# EAGLE design REL1 (EAGLE 5.10)
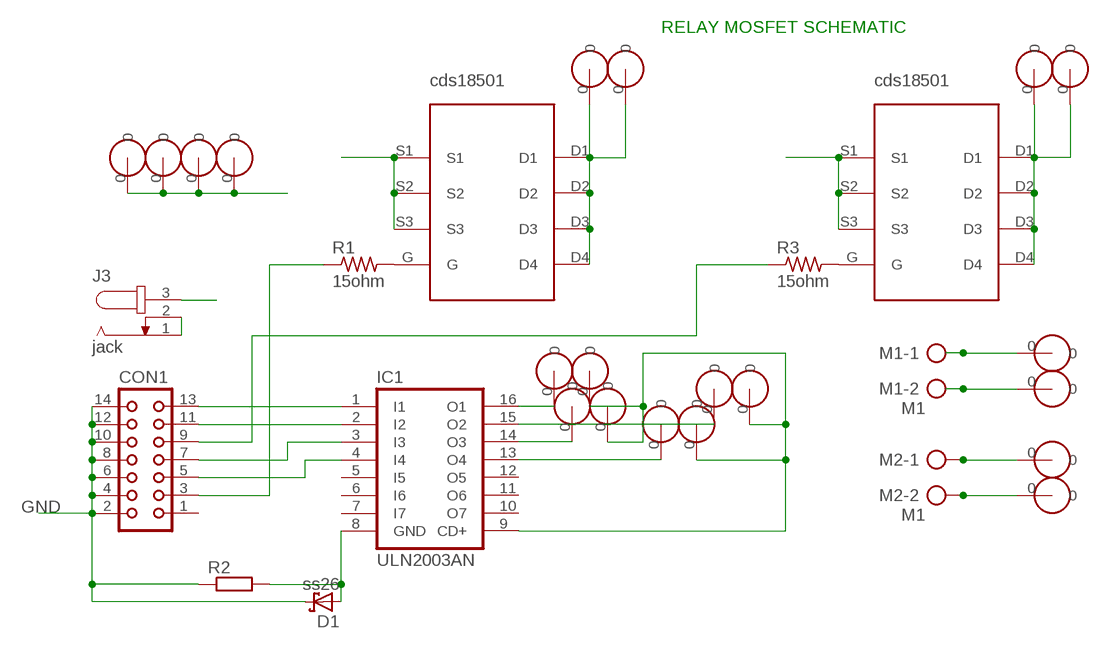
[diagram p0: schematic, sheet 1]

## Parts
24V  PAD0  [SWITCHPAD]
CON1  CON14  [CON14]
D1  ss26  SCHOTTKY-DIODESMD  [SMB]
IC1  ULN2003AN  [DIL16]
J3  jack  JACK-PLUG0  [SPC4077]
M1  M1  AK300/2  [AK300/2]
M2  M1  AK300/2  [AK300/2]
R1  15ohm  R-US_M1206  [M1206]
R2  R-EU_0414/15  [0414/15]
R3  15ohm  R-US_M1206  [M1206]
U$1  PAD0  [SWITCHPAD]
U$2  PAD0  [SWITCHPAD]
U$3  PAD0  [SWITCHPAD]
U$4  PAD0  [SWITCHPAD]
U$5  PAD0  [SWITCHPAD]
U$6  PAD0  [SWITCHPAD]
U$7  PAD0  [SWITCHPAD]
U$8  PAD0  [SWITCHPAD]
U$9  PAD0  [SWITCHPAD]
U$10  PAD0  [SWITCHPAD]
U$11  CSD18503GDS-NEW  [CDS]
U$12  CSD18503GDS-NEW  [CDS]
U$13  PAD0  [SWITCHPAD]
U$14  PAD0  [SWITCHPAD]
U$15  PAD0  [SWITCHPAD]
U$16  PAD0  [SWITCHPAD]
U$17  PAD0  [SWITCHPAD]
U$18  PAD0  [SWITCHPAD]
U$19  PAD0  [SWITCHPAD]
U$20  PAD0  [SWITCHPAD]
U$21  PAD0  [SWITCHPAD]

## Nets
24V: 24V.0 IC1.9(CD+) J3.3 U$3.0 U$4.0 U$6.0 U$8.0 U$9.0 U$10.0 U$21.0
GND: CON1.2 CON1.4 CON1.6 CON1.8 CON1.10 CON1.12 CON1.14 D1.C J3.1 J3.2 R2.1 U$11.S1 U$11.S2 U$11.S3 U$12.S1 U$12.S2 U$12.S3
N$2: IC1.16(O1) U$1.0
N$3: CON1.5 IC1.4(I4)
N$4: IC1.14(O3) U$5.0
N$5: CON1.7 IC1.3(I3)
N$6: IC1.13(O4) U$7.0
N$7: CON1.11 IC1.2(I2)
N$8: CON1.13 IC1.1(I1)
N$9: IC1.15(O2) U$2.0
N$10: R1.2 U$11.G
N$11: R3.2 U$12.G
N$12: CON1.3 R1.1
N$13: CON1.9 R3.1
N$14: U$11.D1 U$11.D2 U$11.D3 U$11.D4 U$13.0 U$15.0
N$15: D1.A IC1.8(GND) R2.2
N$16: U$12.D1 U$12.D2 U$12.D3 U$12.D4 U$14.0 U$16.0
N$17: M1.2 U$18.0
N$18: M1.1 U$17.0
N$19: M2.1 U$19.0
N$20: M2.2 U$20.0
Unconnected: CON1.1 IC1.5(I5) IC1.6(I6) IC1.7(I7) IC1.10(O7) IC1.11(O6) IC1.12(O5)

## Notes on the sheet
- RELAY MOSFET SCHEMATIC

## Library data of the parts
24V U$1-U$10 U$13-U$21 = switchpad:PAD
CON1 = con-harting:CON14: CONNECTOR
D1 = diode:SCHOTTKY-DIODE: Schottky Diode
IC1 = uln-udn:ULN2003A: DRIVER ARRAY
J3 = con-jack:JACK-PLUG: DC POWER JACK Power Jack, DC, Right Angle, Through Hole, Rated 5A at 16VDC, PC Terminals Distributor: Farnell (www.Farnell.de) Drawing: 84N1161.pdf / 84N1162.pdf Manufacturer: SPC Technology (www.spctechnology.com) Type: SPC4077 / SPC 4078
M1 M2 = con-ptr500:AK300/2: CONNECTOR
R1 R3 = rcl:R-US_: RESISTOR, American symbol
R2 = rcl:R-EU_: RESISTOR, European symbol
U$11 U$12 = cds_new:CSD18503GDS-NEW

## Board
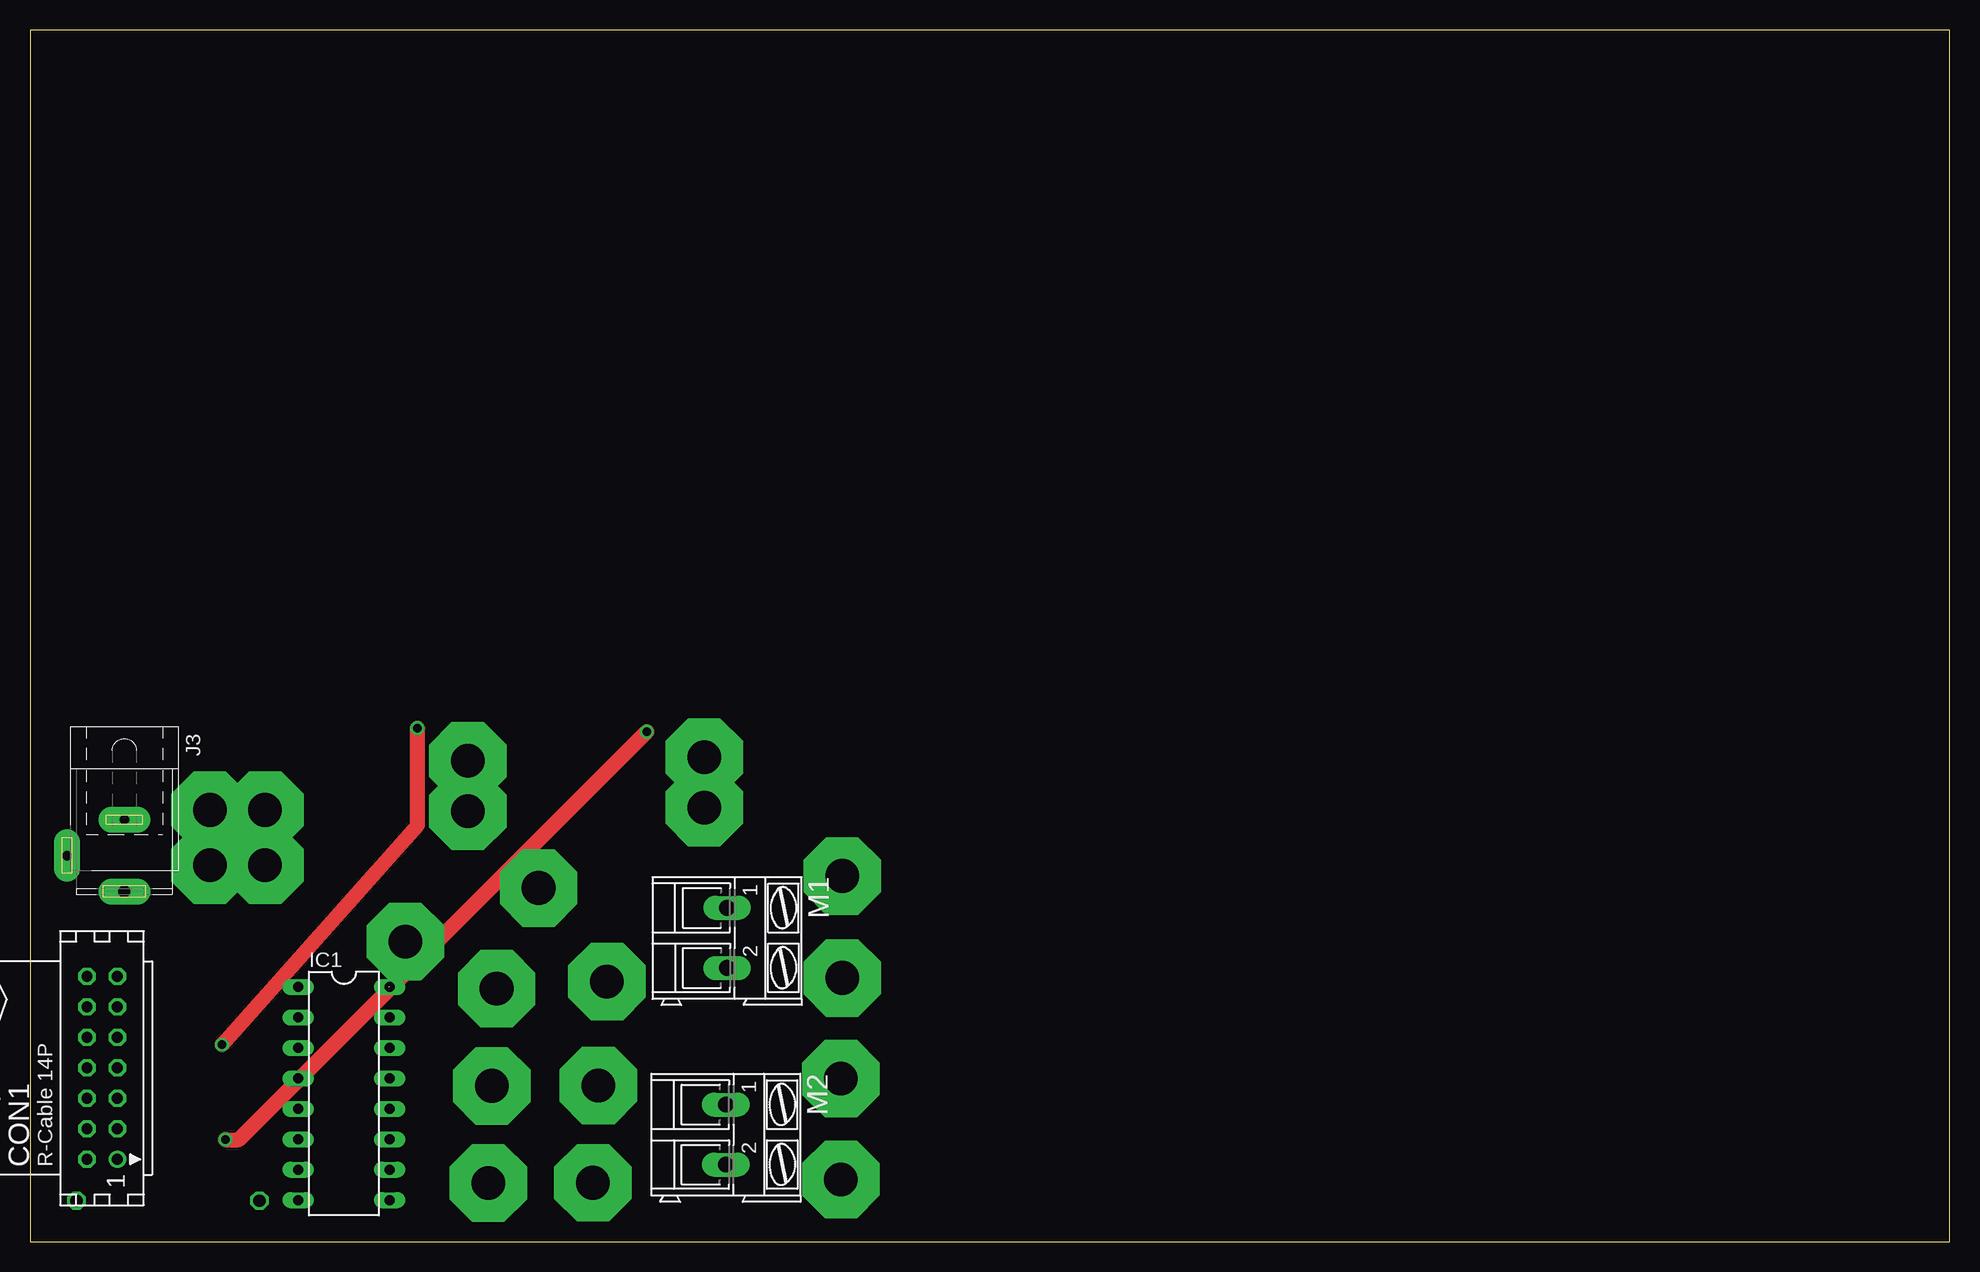
[diagram p1: board, top side]
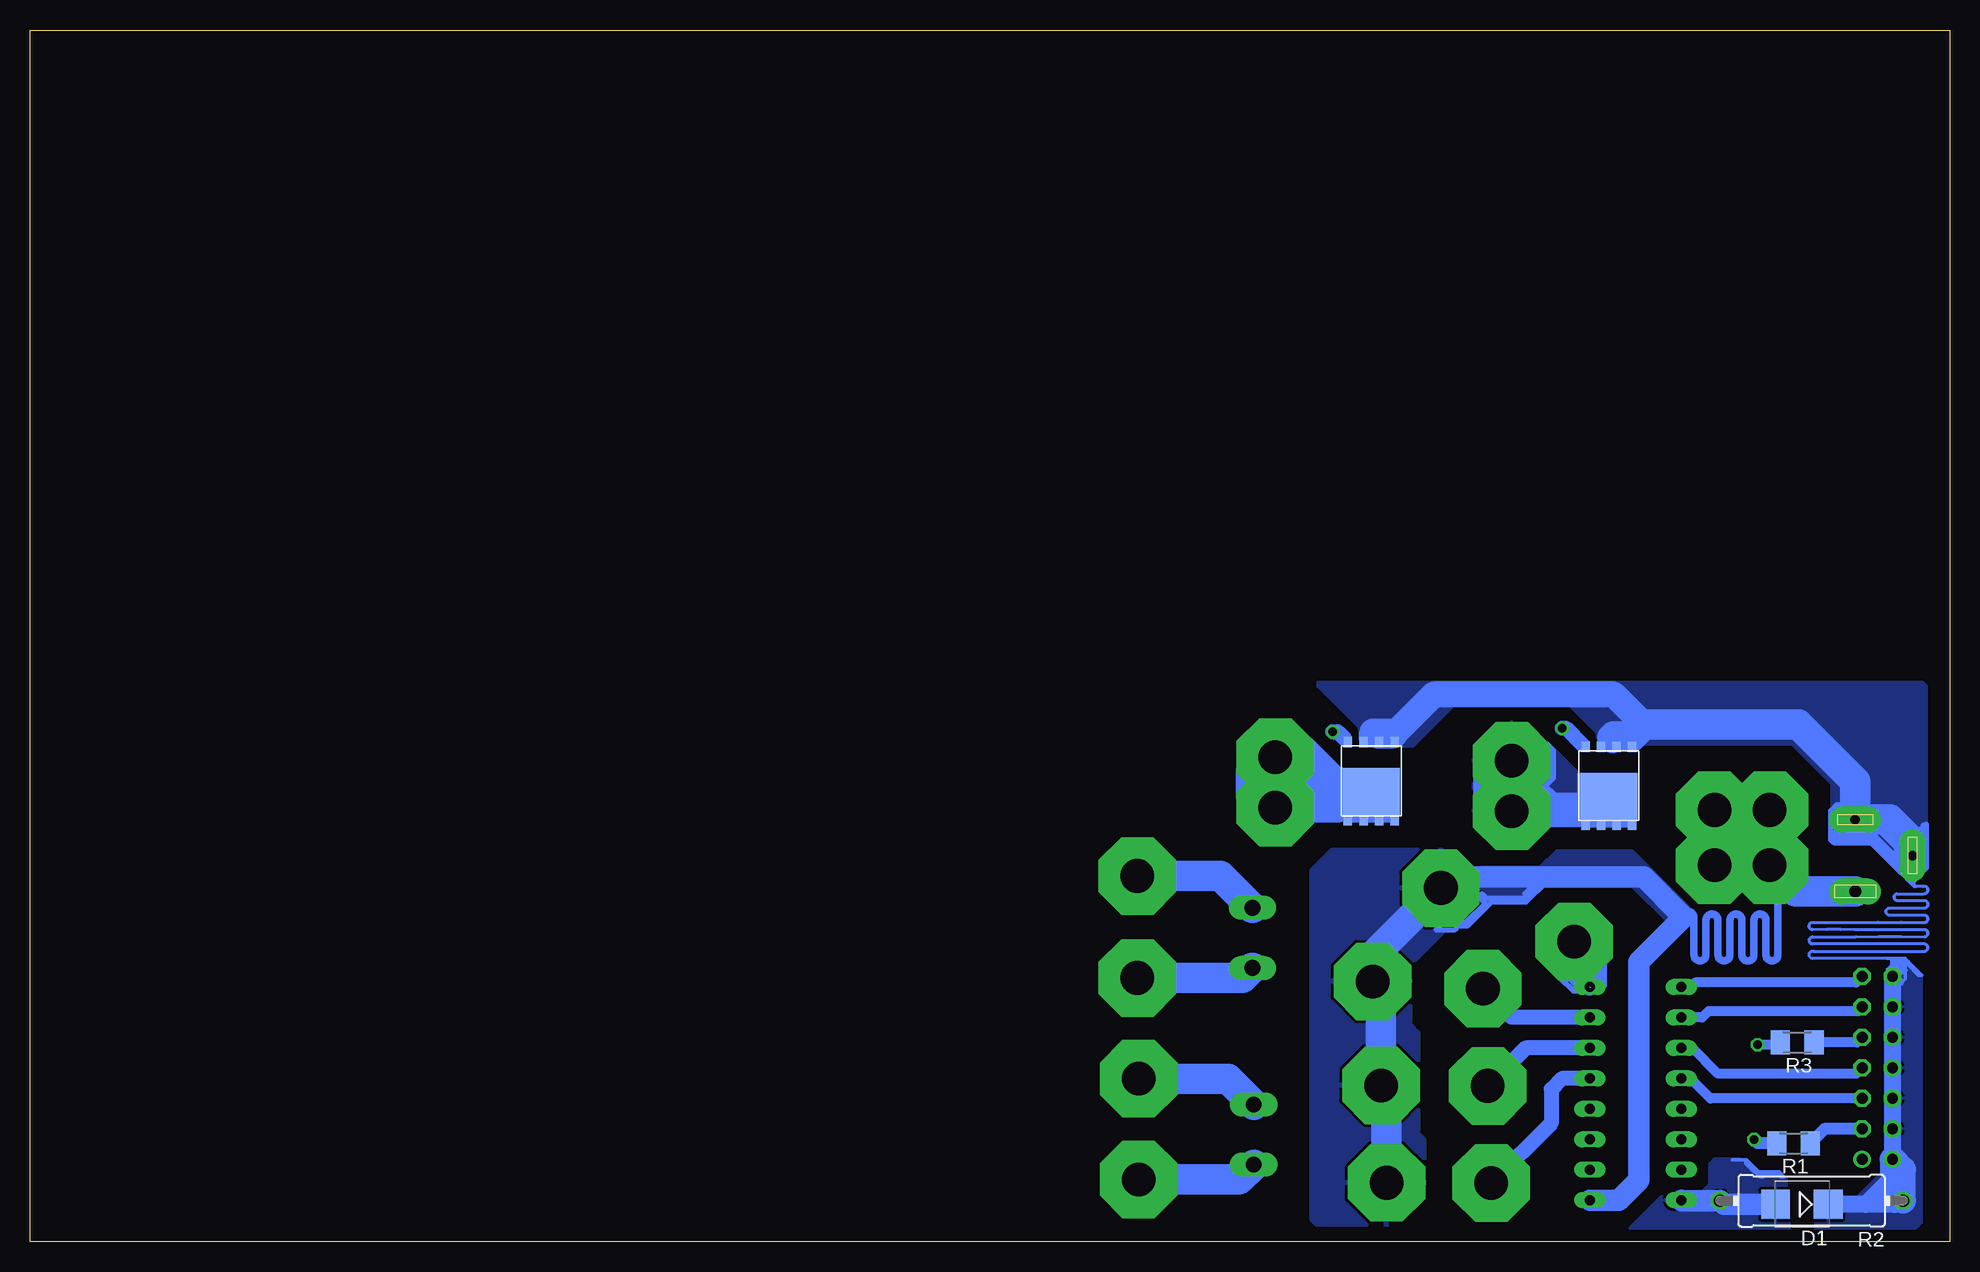
[diagram p2: board, bottom side, seen from below]

Size 160 x 101 mm. Coordinates in mm from the lower left corner, seen from the top.
Outline: 0,0 160,0 160,101 0,101 0,0
Copper layers (1*16): Top 0.035mm / dielectric 1.5mm / Bottom 0.035mm
Design rules "default": minimum track width 10mil, minimum drill 24mil, track to track 8mil, track to pad 8mil, pad to pad 8mil, via to via 8mil, smd to smd 8mil, copper to edge 40mil, drill to drill 8mil, minimum pad ring 10mil, minimum via ring 8mil, stop-mask expansion 4mil, vias tented up to drill 0mil, thermal gap 10mil

### Footprints (pad centres in the part's own frame; a part is rotated, then mirrored left to right if it is on the bottom)
SWITCHPAD = drill 2.8 pad 6.452 octagon: 0 0.093,0.175
CON14 = drill 0.914 round: 1 -7.62,-1.27 | drill 0.914 octagon: 2 -7.62,1.27; 3 -5.08,-1.27; 4 -5.08,1.27; 5 -2.54,-1.27; 6 -2.54,1.27; 7 0,-1.27; 8 0,1.27; 9 2.54,-1.27; 10 2.54,1.27; 11 5.08,-1.27; 12 5.08,1.27; 13 7.62,-1.27; 14 7.62,1.27
SMB = smd 2.4 x 2.4: A 2.2,0; C -2.2,0
DIL16 = drill 0.813 long: 1 -8.89,-3.81; 2 -6.35,-3.81; 3 -3.81,-3.81; 4 -1.27,-3.81; 5 1.27,-3.81; 6 3.81,-3.81; 7 6.35,-3.81; 8 8.89,-3.81; 9 8.89,3.81; 10 6.35,3.81; 11 3.81,3.81; 12 1.27,3.81; 13 -1.27,3.81; 14 -3.81,3.81; 15 -6.35,3.81; 16 -8.89,3.81
SPC4077 = drill 0.8 pad 2.184 long: 1 -3,0; 2 0,-4.8 | drill 1 pad 2.184 long: 3 3,0
AK300/2 = drill 1.321 long: 1 -2.515,0; 2 2.489,0
M1206 = smd 1.6 x 2: 1 -1.4,0; 2 1.4,0
0414/15 = drill 1.016 octagon: 1 -7.62,0; 2 7.62,0
CDS = smd 0.406 x 0.203: D1 1,-0.9; D2 1,0.4; D3 1,1.7; D4 1,3; G 7.1,2.9; P$1 7.2,3.1; P$2 7.2,2.9; P$3 7.2,2.7; P$4 7.5,1.9; P$5 7.6,3.1; P$6 7.6,2.9; P$7 7.6,2.7; P$8 7.6,1.9; P$9 7.1,3.1; P$11 7.1,2.7; P$12 7.5,1.7; P$13 7.2,-1.1; P$14 7.6,-1.1; P$16 7.6,-0.9; P$17 7.1,-0.9; P$18 7.1,-1.1; P$19 7.1,-0.7; P$20 7.5,-0.7; P$21 7.6,-0.7; P$22 7.1,-1.2; P$23 7.5,-1.2; P$24 7.6,-1.2; P$25 7.1,3.2; P$26 7.5,3.2; P$27 7.6,3.2; P$28 7.1,0.1; P$30 7.1,0.5; P$31 7.1,0.6; P$32 7.1,1.4; P$34 7.1,1.8; P$35 7.1,1.9; P$36 7.6,1.7; P$37 7.5,1.5; P$38 7.6,1.5; P$39 7.5,1.4; P$40 7.6,1.4; P$41 7.5,0.6; P$42 7.6,0.6; P$43 7.5,0.4; P$44 7.6,0.4; P$45 7.5,0.2; P$46 7.6,0.2; P$47 7.5,0.1; P$48 7.6,0.1; P$68 1,3.2; P$69 0.6,3.2; P$70 0.6,3; P$72 1.1,3.2; P$73 1.2,3; P$74 0.6,2.8; P$75 1,2.8; P$76 1.1,2.8; P$77 0.6,2.7; P$78 1,2.7; P$79 1.1,2.7; P$80 1.1,1.9; P$81 0.7,1.9; P$82 0.6,1.9; P$83 0.6,1.7; P$85 1.1,1.7; P$86 0.6,1.5; P$87 1,1.5; P$88 1.2,1.5; P$89 0.6,1.4; P$90 1,1.4; P$91 1.2,1.4; P$92 0.6,0.6; P$93 1,0.6; P$94 1.1,0.6; P$95 0.6,0.4; P$97 1.2,0.4; P$98 0.6,0.2; P$99 1,0.2; P$100 1.2,0.2; P$101 0.6,0.1; P$102 1,0.1; P$103 1.1,0.1; P$104 0.6,-0.7; P$105 0.9,-0.7; P$106 1.1,-0.7; P$107 0.6,-0.9; P$109 1.1,-0.9; P$110 0.6,-1.1; P$111 1.1,-1.1; P$112 1,-1.1; P$113 0.6,-1.2; P$114 1,-1.2; P$115 1.1,-1.2; S1 7.2,-0.9; S2 7.1,0.3; S3 7.1,1.6 | smd 1.93 x 0.965: P$49 4.2,-0.9; P$50 2.3,-0.9; P$51 2.3,0; P$52 4.2,0; P$53 4.2,0.9; P$54 2.3,0.9; P$55 4.2,1.8; P$56 2.3,1.8; P$57 2.3,2.7; P$58 4.2,2.7; P$59 4.2,2.9; P$60 2.3,2.9; P$61 2.2,2.9; P$62 2.2,1.9; P$63 2.2,2; P$64 2.2,1; P$65 2.2,0; P$66 2.2,0.1; P$67 2.2,-0.9

### Placement (x,y rotation side)
24V  47.1,4.8 90 top
CON1  6.02,14.47 90 top
D1  12.3,3.1 180 bottom
IC1  26.17,12.33 270 top
J3  7.87,32.18 270 top
M1  58.1,25.3 270 top
M2  58,8.9 270 top
R1  13,8.2 180 bottom
R2  11.5,3.4 180 bottom
R3  12.7,16.6 180 bottom
U$1  31.19,24.83 0 top
U$2  38.8,20.9 0 top
U$3  14.9,31.2 0 top
U$4  19.5,31.2 0 top
U$5  38.4,12.8 0 top
U$6  14.9,35.8 0 top
U$7  38.1,4.7 0 top
U$8  19.5,35.8 0 top
U$9  42.3,29.3 0 top
U$10  48,21.5 0 top
U$11  47.2,34.3 90 bottom
U$12  27.4,33.9 90 bottom
U$13  56.1,36 0 top
U$14  36.4,35.7 0 top
U$15  56.1,40.2 0 top
U$16  36.4,39.9 0 top
U$17  67.6,30.3 0 top
U$18  67.6,21.8 0 top
U$19  67.5,13.4 0 top
U$20  67.5,5 0 top
U$21  47.2,13.1 270 top

### Tracks (layer width: path | path; a pad name or v marks a point on that pad's centre or on a via)
24V
  Bottom 0.406: 33.6,30 35.3,28.3 38.2,28.3 40.2,26.3 40.9,26.3 41.2,26 42.8,26 42.2,26.6 40.3,26.6 38.7,28.2 39,28.5 39,29 38.6,28.6 35.3,28.6 35.4,28.7 35.4,29 35,29.4 34.6,29.4 35.1,28.9
  Bottom 0.61: U$3.0 arc90 14.3,30.68 14.3,23.9 arc180 15.3,23.9 15.3,26.8 arc-180 16.3,26.8 16.3,23.9 arc169 17.3,23.8 17.3,26.8 arc-180 18.3,26.8 18.3,23.9 arc180 19.3,23.9 19.3,26.8 arc-180 20.3,26.8 20.3,23.9 arc180 21.3,23.9 21.3,27 arc-191 22.3,26.9
  Bottom 1.778: IC1.9 27.56,3.44 25.9,5.1 25.9,23.3 22.3,26.9 22.3,27.2 25.5,30.4 41.47,30.4 U$9.0 | U$3.0 U$4.0
  Bottom 2.54: J3.3 12.8,29.18 U$3.0 | U$9.0 48.09,23.77 U$10.0 47.38,20.96 U$21.0 46.92,12.56 24V.0
  Bottom 3.81: U$4.0 U$8.0 U$6.0
  pour Bottom: 43.8,1.9 43.8,8.5 44.3,9 44.3,17.4 45,18.1 45,23.1 39.7,28.4 36.3,28.4 35,29.7 26.4,29.7 23.5,26.8 22.5,26.8 21.7,27.6 21.7,27.7 25.3,31.3 26.5,32.5 32.7,32.5 34.1,31.1 39.4,31.1 40.9,32.6 49.8,32.6 51.5,32.6 53.2,30.9 53.2,1.9 52.8,1.5 44.2,1.5
  pour Bottom: 34.1,29.8 43.1,29 42.4,29.7 34.1,29.7 34,29.8
GND  (1 unrouted)
  Bottom 0.254: CON1.14 4.75,23.15 | J3.2 3.07,30.43 arc90 3.1,30.4 3.1,29.8 arc-90 2.9,29.6 2.2,29.6 arc199 2.1,29 4.4,29 arc-161 4.3,28.4 2,28.4 arc163 2.1,27.8 arc-2 5,27.8 arc-178 5,27.2 arc-2 2.1,27.2 arc182 2.1,26.6 arc-2 7.9,26.6 11.5,26.6 arc-163 11.4,26 arc2 7.9,26 arc-2 2.1,26 arc182 2.1,25.4 arc-2 7.8,25.4 11.4,25.4 arc-180 11.4,24.8 2.1,24.8 arc180 2.1,24.2 11.3,24.2 arc-199 11.4,23.6 5.2,23.6 5.1,23.6 arc90 4.75,23.25 4.75,23.15 | 4.7,23.2 4.2,22.7 4.2,22.1 4.6,22.5 4.6,22.8 4.7,22.9 4.7,23 4.7,23.2 | 4.75,23.15 5.2,22.7 5.2,22.3 4.9,22.6 4.9,22.9 | 4.75,23.15 4.7,23.2 | 3.2,30.15 3.29,30.15 3.29,29.95 3.01,29.67 3.01,29.81 3,29.82 2.99,29.82 2.79,29.62 3,29.62 3.29,29.91 3.3,29.91 4.02,30.63
  Bottom 0.305: 28.1,42 28.1,41.9 28.35,41.65 | 28.35,41.65 U$12.S3 | 26.5,42.1 U$12.S1 | 28.35,41.65 U$12.S2 | U$11.S2 48.7,41.4 49.1,41.8 49.1,42.5 49,42.6 49,41.6 U$11.S3 48.7,41.3 46.4,41.3 46.3,41.4 U$11.S1 46.3,42.2 | 3.8,22.8 4.2,22.8 4.6,23.2 | 4.8,23.4 4.4,23.4 4.3,23.3 | 4,23 3.6,22.6 3.9,22.6 4,22.5 3.9,22.5 3.8,22.4 4,22.4 4,23 | 4.3,23.3 4,23 | 3.4,23.3 4.3,23.3 | 3.3,23.2 2.3,22.2 2.6,22.2 3.5,23.1 3.8,23.1 | 3.4,23.3 3.3,23.2 | 3.8,23.1 3.9,23.1 | 3.8,23.1 3.7,23 3.7,21.9 3.9,21.7 4,21.8 4,21.5 | 3.6,23.5 4.8,23.5 | 3.6,23.5 3.4,23.3 | 4.6,23.2 3.3,23.2 | 4.8,23.4 4.6,23.2 | 4.8,23.4 4.8,23.1 4.7,23 | 5.2,23.6 3.7,23.6 3.6,23.5 | 3,29.7 3,29.82 3,30 2.6,30.4
  Bottom 0.406: 4.7,31.4 3.5,31.4 | 4.7,31.4 4.9,31.6 | 4.9,31.6 6.5,33.2 9.6,33.2 9.9,33.5 9.9,35.9 9.4,36.4 9.2,36.4 9.2,34.5 9.6,34.1 9.6,33.6 9.5,33.5 6.3,33.5 4.4,31.6 4.4,32 6.3,33.9 9.4,33.9 9.2,34.1 5.7,34.1 4.4,32.8 4.4,32.1 4.9,31.6 | 4.7,31.4 4,30.7 4,31.8 2,33.8 2,34.5 2.2,34.7 2.2,34.4 2.3,34.3 2.4,34.4 2.3,34.4 1.9,34.8 1.9,31.2 2.4,30.7
  Bottom 1.422: CON1.14 CON1.12 CON1.10 CON1.8 CON1.6 CON1.4 CON1.2 5.1,6.5 5.1,5.9 5,5.8 5,5.1 5.7,4.4 | 5.7,4.4 7,3.1 | D1.C 4.6,3.1 4.5,3.2 5.7,4.4
  Bottom 2.184: R2.1 3.88,5.98 CON1.2 | 46.3,42.2 47.8,42.2 48.1,42.5 46.1,42.5 43,45.6 28,45.6 25.5,43.1
  Bottom 2.54: J3.2 3.07,33.27 5,35.2 7.85,35.2 J3.1 7.87,38.37 12.6,43.1 25.5,43.1 26.5,42.1 28,42.1 28.1,42
  pour Bottom: 11.2,1.7 11.2,0.5 3.4,0.5 2.6,1.3 2.3,1.6 2.3,22.2 2.9,22.8 5,22.8 5.3,22.5 5.3,6.1 9.9,1.5 9.9,1.9 11,1.9
  pour Bottom: 1.9,32 1.9,46.3 2.2,46.6 52.7,46.6 52.7,46.3 49.2,42.8 49.2,42.7 48.8,42.3 46.8,42.3 45.8,41.3 44.7,41.3 41.3,44.7 31.7,44.7 29.4,42.4 29.4,42 29.2,41.8 26.3,41.8 26,41.5 13.2,41.5 9.8,38.1 9.8,34.6 9.2,34 6.2,34 4.2,32
N$2  (1 unrouted)
  Bottom 0.305: 29.9,21.2 30.3,21.2 30.7,20.8 31.4,20.8 32.6,22 32.3,22 31.2,20.9 31,20.9 30.9,21 31.7,21.8 31.8,21.8 31.9,21.9 30.3,21.9 28.7,23.5 28.7,21.3 29,21 29,23 28.9,23.1 28.9,22.9 29.8,22 29.2,22 29.2,22.3 29.3,22.2 29.3,22.6 28.2,23.7 28.2,24 28.3,24.1 28.8,23.6
  Bottom 1.27: 31.28,22.52 U$1.0
  Bottom 1.422: IC1.16 31.28,22.52
N$3
  Bottom 0.813: CON1.5 19.93,11.93 21.6,13.6 IC1.4
N$4
  Bottom 1.27: IC1.14 35.33,16.14 U$5.0
N$5
  Bottom 0.813: IC1.3 22.32,16.1 21.4,16.1 19.3,14 7.76,14 CON1.7
N$6
  Bottom 1.27: IC1.13 32.3,13.6 33.2,12.7 33.2,9.87 U$7.0
N$7
  Bottom 0.813: CON1.11 7.64,19.2 20.1,19.2 20.62,18.68 IC1.2
N$8
  Bottom 0.813: CON1.13 7.78,21.6 21.2,21.6 21.58,21.22 IC1.1
N$9
  Bottom 1.27: IC1.15 29.98,18.7 36.52,18.7 U$2.0
N$10  (via drill 0.7)
  Top 1.27: v16.3,8.5 17.4,8.5 v51.4,42.5
  Bottom 0.406: 50.4,41.9 50.4,41.7 U$11.G
  Bottom 1.016: R1.2 16,8.2 v16.3,8.5
  Bottom 1.27: v51.4,42.5 51,42.5 50.4,41.9
N$11  (via drill 0.7)
  Top 1.27: v16,16.4 32.3,34.7 v32.3,42.8
  Bottom 0.305: 30.6,41.4 30.6,41.3 U$12.G
  Bottom 0.813: R3.2 14.3,16.4 v16,16.4
  Bottom 1.27: v32.3,42.8 32,42.8 30.6,41.4
N$12
  Bottom 1.016: CON1.3 10.41,9.39 R1.1
N$13
  Bottom 0.813: CON1.9 7.7,16.6 R3.1
N$14
  Bottom 0.61: 48.8,39.2 50.8,39.2 53.3,41.7 53.3,41.2 50.8,38.7 50.8,38.2 51.5,37.5 | 51.5,37.5 54.5,37.5 54.8,37.8 52,37.8 51.2,38.6 52,38.6 52.3,38.3 53.4,38.3 | 53.4,38.3 53.5,38.3 | 53.4,38.3 52.8,38.9 52.6,38.9 52.4,38.7 52,38.7 51.7,39 51.9,39 52.2,39.3 52.7,39.3 52.8,39.4 52.7,39.4 52.4,39.7 52.6,39.7 52.9,40 52.9,40.1 53.1,40.3 58.1,40.3 59.1,39.3 59.2,39.3 59.2,37 59,36.8 59,38.3 58.9,38.4 56.9,38.4 53.7,35.2 | 50.5,36.7 51.5,36.7 51.5,37.5
  Bottom 0.813: U$11.D1 U$11.D2 U$11.D3 U$11.D4 50.5,35.6 50.5,36.7
  Bottom 2.54: 50.5,36.7 51.02,36.17 U$13.0 U$15.0
N$15
  Bottom 0.305: 18.1,6.8 16.9,6.8 15.5,5.4 15.8,5.4 17,6.6 17,6.5 16.3,5.8 14.2,5.8 13.8,5.4 14.1,5.4 14.3,5.6 15.4,5.6 15.5,5.5
  Bottom 1.778: D1.A 18.82,3.1 R2.2 22.32,3.4 IC1.8
  pour Bottom: 13.4,1.9 13.4,0.8 13.7,0.5 27.1,0.5 27.1,0.7 23.6,4.2 20.6,4.2 20,4.8 20,6.5 19.6,6.9 17.5,6.9 16,5.4 13.8,5.4 13.6,5.2 13.6,2.1
N$16
  Bottom 0.254: 30.9,37.1 30.9,39
  Bottom 0.61: 39.4,37.6 39.4,40.5 38.5,41.4 33.6,41.4 33.1,40.9 33.1,38.7 33.8,38 32.9,37.1 30.9,37.1 30.8,37.1 30.8,35.8 31,35.8 | 39.4,37.6 39.4,36.6 | 39.4,37.6 39,38 39,35.8
  Bottom 0.813: U$12.D3 30.1,34.9 31,35.8 | U$12.D1 U$12.D2 U$12.D3 | U$12.D3 U$12.D4
  Bottom 2.54: 31,35.8 36.42,35.8 U$14.0 U$16.0
  pour Bottom: 26,39 26,34.8 38.9,34.8 39.7,35.6 39.7,43.3 35.2,43.3 30.5,38.6 26.4,38.6
N$17
  Bottom 2.54: M1.2 58.94,21.98 U$18.0
N$18
  Bottom 2.54: M1.1 60.76,30.48 U$17.0
N$19
  Bottom 2.54: M2.1 60.16,13.57 U$19.0
N$20
  Bottom 2.54: M2.2 59.24,5.17 U$20.0